# Altium project PWR_MANAGE.PRJPCB
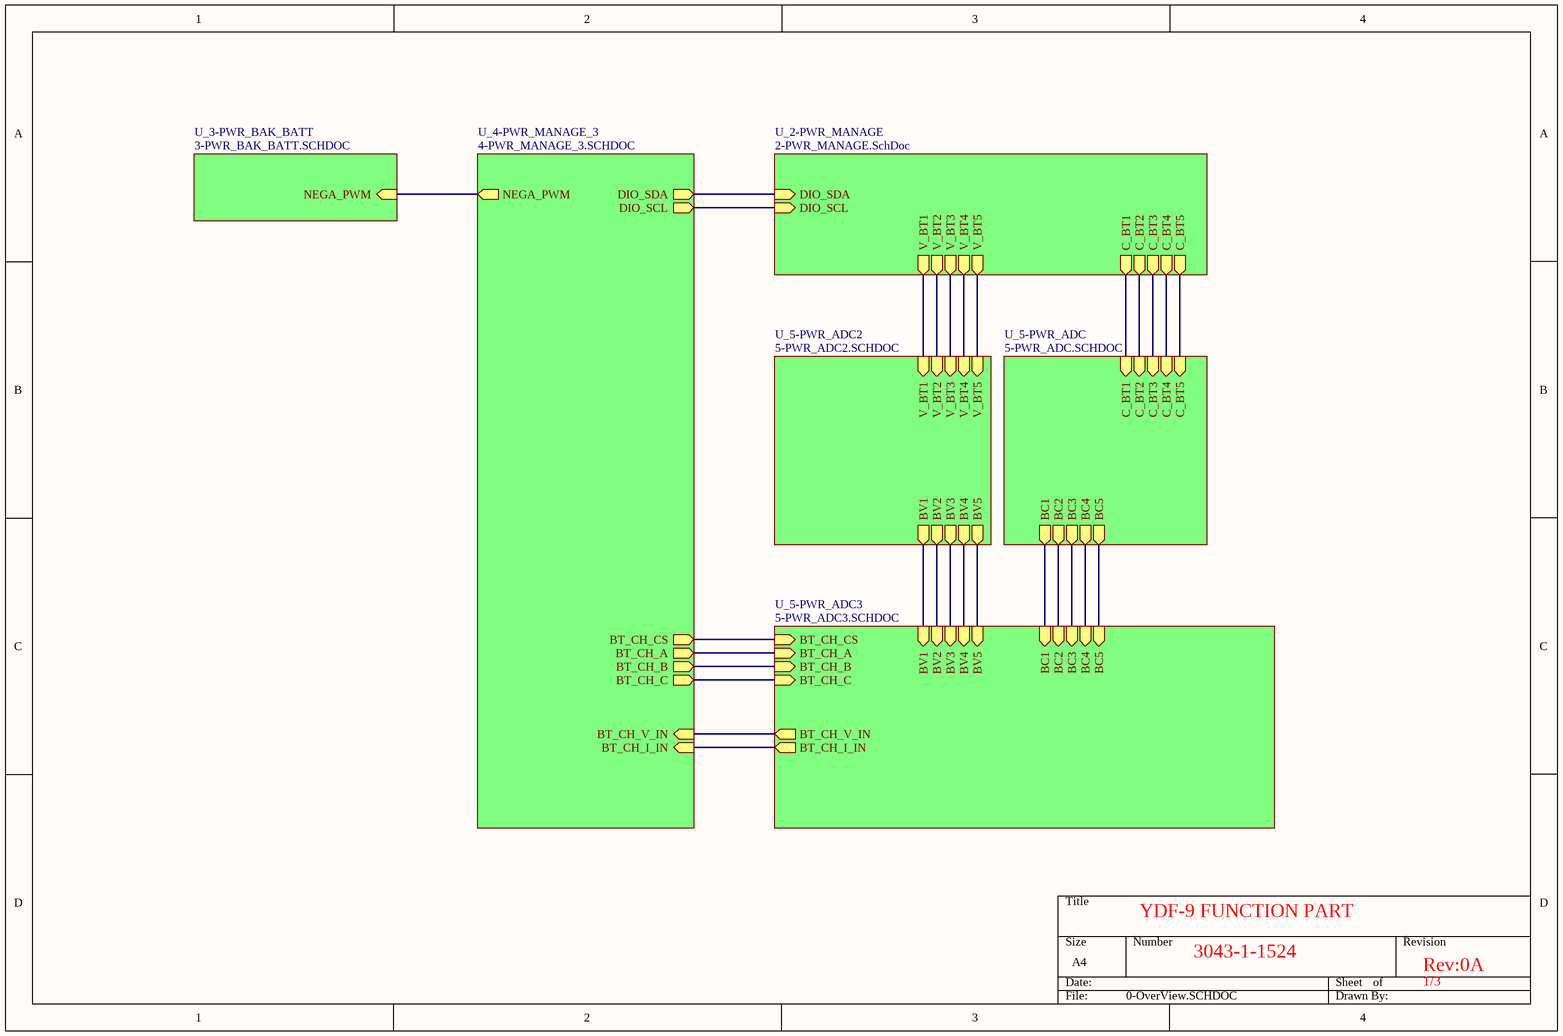
[diagram p0: 0-OverView.SCHDOC]
.TITLE: aaaaa
7 sheets, 171 parts. Net scope: hierarchical (ports join the sheet entries above them; power ports are global).
Board file: 3043-1-1532_Rev01.PcbDoc
Sheets:
  0-OverView.SCHDOC
    U_2-PWR_MANAGE = 2-PWR_MANAGE.SchDoc
    U_3-PWR_BAK_BATT = 3-PWR_BAK_BATT.SCHDOC
    U_4-PWR_MANAGE_3 = 4-PWR_MANAGE_3.SCHDOC
    U_5-PWR_ADC = 5-PWR_ADC.SCHDOC
    U_5-PWR_ADC2 = 5-PWR_ADC2.SCHDOC
    U_5-PWR_ADC3 = 5-PWR_ADC3.SCHDOC

## Sheet 0-OverView.SCHDOC
size A4

### Sub-sheets
U_2-PWR_MANAGE = 2-PWR_MANAGE.SchDoc: V_BT1 (out), V_BT2 (out), V_BT3 (out), V_BT4 (out), V_BT5 (out), C_BT1 (out), C_BT2 (out), C_BT3 (out), C_BT4 (out), C_BT5 (out), DIO_SDA (in), DIO_SCL (in)
U_3-PWR_BAK_BATT = 3-PWR_BAK_BATT.SCHDOC: NEGA_PWM (in)
U_4-PWR_MANAGE_3 = 4-PWR_MANAGE_3.SCHDOC: BT_CH_I_IN (in), BT_CH_V_IN (in), DIO_SDA (out), DIO_SCL (out), NEGA_PWM (out), BT_CH_CS (out), BT_CH_A (out), BT_CH_B (out), BT_CH_C (out)
U_5-PWR_ADC = 5-PWR_ADC.SCHDOC: C_BT1 (in), C_BT2 (in), C_BT3 (in), C_BT4 (in), C_BT5 (in), BC1 (out), BC2 (out), BC3 (out), BC4 (out), BC5 (out)
U_5-PWR_ADC2 = 5-PWR_ADC2.SCHDOC: V_BT1 (in), V_BT2 (in), V_BT3 (in), V_BT4 (in), V_BT5 (in), BV2 (out), BV3 (out), BV4 (out), BV5 (out), BV1 (out)
U_5-PWR_ADC3 = 5-PWR_ADC3.SCHDOC: BT_CH_CS (in), BT_CH_A (in), BT_CH_B (in), BT_CH_C (in), BT_CH_V_IN (out), BT_CH_I_IN (out), BC1 (in), BC2 (in), BC3 (in), BC4 (in), BC5 (in), BV1 (in), BV2 (in), BV3 (in), BV4 (in), BV5 (in)

### Nets
BC1: sheet U_5-PWR_ADC/BC1, sheet U_5-PWR_ADC3/BC1
BC2: sheet U_5-PWR_ADC/BC2, sheet U_5-PWR_ADC3/BC2
BC3: sheet U_5-PWR_ADC/BC3, sheet U_5-PWR_ADC3/BC3
BC4: sheet U_5-PWR_ADC/BC4, sheet U_5-PWR_ADC3/BC4
BC5: sheet U_5-PWR_ADC/BC5, sheet U_5-PWR_ADC3/BC5
BT_CH_A: sheet U_4-PWR_MANAGE_3/BT_CH_A, sheet U_5-PWR_ADC3/BT_CH_A
BT_CH_B: sheet U_4-PWR_MANAGE_3/BT_CH_B, sheet U_5-PWR_ADC3/BT_CH_B
BT_CH_C: sheet U_4-PWR_MANAGE_3/BT_CH_C, sheet U_5-PWR_ADC3/BT_CH_C
BT_CH_CS: sheet U_4-PWR_MANAGE_3/BT_CH_CS, sheet U_5-PWR_ADC3/BT_CH_CS
BT_CH_I_IN: sheet U_4-PWR_MANAGE_3/BT_CH_I_IN, sheet U_5-PWR_ADC3/BT_CH_I_IN
BT_CH_V_IN: sheet U_4-PWR_MANAGE_3/BT_CH_V_IN, sheet U_5-PWR_ADC3/BT_CH_V_IN
BV1: sheet U_5-PWR_ADC2/BV1, sheet U_5-PWR_ADC3/BV1
BV2: sheet U_5-PWR_ADC2/BV2, sheet U_5-PWR_ADC3/BV2
BV3: sheet U_5-PWR_ADC2/BV3, sheet U_5-PWR_ADC3/BV3
BV4: sheet U_5-PWR_ADC2/BV4, sheet U_5-PWR_ADC3/BV4
BV5: sheet U_5-PWR_ADC2/BV5, sheet U_5-PWR_ADC3/BV5
C_BT1: sheet U_2-PWR_MANAGE/C_BT1, sheet U_5-PWR_ADC/C_BT1
C_BT2: sheet U_2-PWR_MANAGE/C_BT2, sheet U_5-PWR_ADC/C_BT2
C_BT3: sheet U_2-PWR_MANAGE/C_BT3, sheet U_5-PWR_ADC/C_BT3
C_BT4: sheet U_2-PWR_MANAGE/C_BT4, sheet U_5-PWR_ADC/C_BT4
C_BT5: sheet U_2-PWR_MANAGE/C_BT5, sheet U_5-PWR_ADC/C_BT5
DIO_SCL: sheet U_2-PWR_MANAGE/DIO_SCL, sheet U_4-PWR_MANAGE_3/DIO_SCL
DIO_SDA: sheet U_2-PWR_MANAGE/DIO_SDA, sheet U_4-PWR_MANAGE_3/DIO_SDA
NEGA_PWM: sheet U_3-PWR_BAK_BATT/NEGA_PWM, sheet U_4-PWR_MANAGE_3/NEGA_PWM
V_BT1: sheet U_2-PWR_MANAGE/V_BT1, sheet U_5-PWR_ADC2/V_BT1
V_BT2: sheet U_2-PWR_MANAGE/V_BT2, sheet U_5-PWR_ADC2/V_BT2
V_BT3: sheet U_2-PWR_MANAGE/V_BT3, sheet U_5-PWR_ADC2/V_BT3
V_BT4: sheet U_2-PWR_MANAGE/V_BT4, sheet U_5-PWR_ADC2/V_BT4
V_BT5: sheet U_2-PWR_MANAGE/V_BT5, sheet U_5-PWR_ADC2/V_BT5

### Notes on the sheet
- YDF-9 FUNCTION PART
- 3043-1-1524
- Rev:0A
- 1/3

## Sheet 2-PWR_MANAGE.SchDoc
size A4
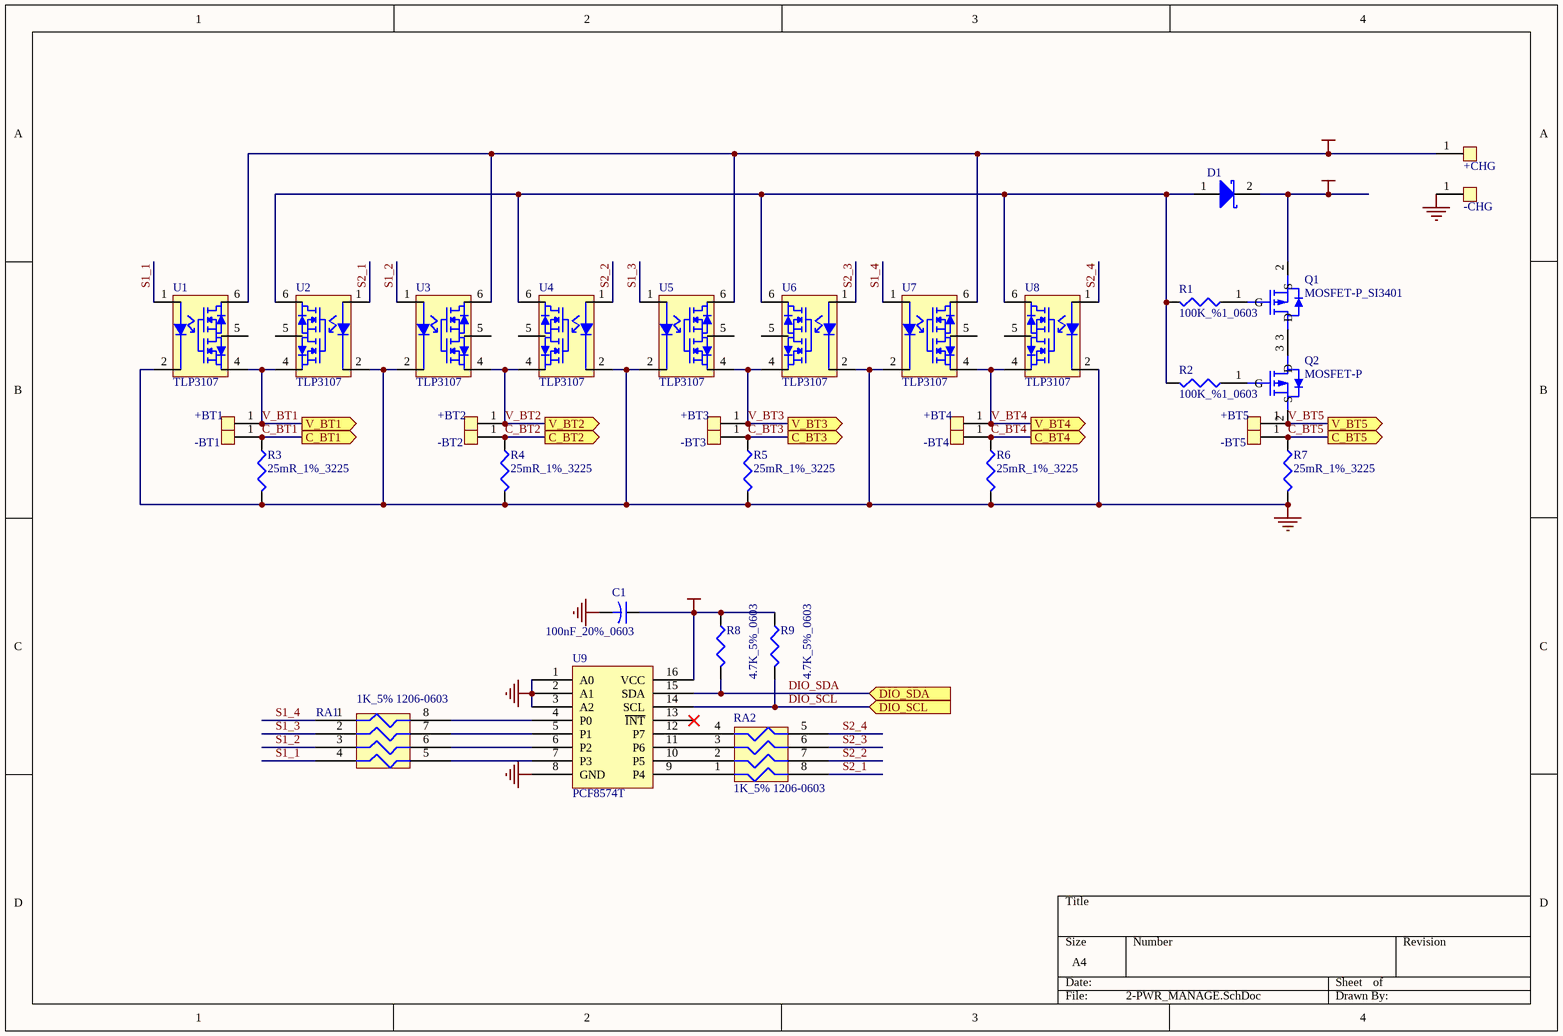
[diagram p1: 2-PWR_MANAGE.SchDoc]

### Parts
+BT1  ND  [END_1.5_2.2]  (value not drawn)
+BT2  ND  [END_1.5_2.2]  (value not drawn)
+BT3  ND  [END_1.5_2.2]  (value not drawn)
+BT4  ND  [END_1.5_2.2]  (value not drawn)
+BT5  ND  [END_1.5_2.2]  (value not drawn)
+CHG  ND  [END_1.5_2.2]  (value not drawn)
-BT1  ND  [END_1.5_2.2]  (value not drawn)
-BT2  ND  [END_1.5_2.2]  (value not drawn)
-BT3  ND  [END_1.5_2.2]  (value not drawn)
-BT4  ND  [END_1.5_2.2]  (value not drawn)
-BT5  ND  [END_1.5_2.2]  (value not drawn)
-CHG  ND  [END_1.5_2.2]  (value not drawn)
C1  100nF_20%_0603  [C1608-0603]
D1  D Schottky  [DO-214AA_785X100_200X160A100L_P]  (value not drawn)
Q1  MOSFET-P_SI3401  [SO-G3/C2.5]
Q2  MOSFET-P  [SO-G3/C2.5]
R1  value 100K_%1_0603  [C1608-0603]  (hidden comment: Res3)
R2  value 100K_%1_0603  [C1608-0603]  (hidden comment: Res3)
R3  25mR_1%_3225  [CR6332-2512]
R4  25mR_1%_3225  [CR6332-2512]
R5  25mR_1%_3225  [CR6332-2512]
R6  25mR_1%_3225  [CR6332-2512]
R7  25mR_1%_3225  [CR6332-2512]
R8  4.7K_5%_0603  [C1608-0603]
R9  4.7K_5%_0603  [C1608-0603]
RA1  1K_5% 1206-0603  [RCA-4]
RA2  1K_5% 1206-0603  [RCA-4]
U1  TLP3107  [SO-6_P2.54_B7]
U2  TLP3107  [SO-6_P2.54_B7]
U3  TLP3107  [SO-6_P2.54_B7]
U4  TLP3107  [SO-6_P2.54_B7]
U5  TLP3107  [SO-6_P2.54_B7]
U6  TLP3107  [SO-6_P2.54_B7]
U7  TLP3107  [SO-6_P2.54_B7]
U8  TLP3107  [SO-6_P2.54_B7]
U9  PCF8574T  [SOP16_P1.27_B10]

### Ports
C_BT1 (out), C_BT2 (out), C_BT3 (out), C_BT4 (out), C_BT5 (out), DIO_SCL (in), DIO_SDA (in), V_BT1 (out), V_BT2 (out), V_BT3 (out), V_BT4 (out), V_BT5 (out)

### Nets
GND: -CHG.1(SW) C1.2 R3.2 R4.2 R5.2 R6.2 R7.2 U1.2(K) U2.2(K) U3.2(K) U4.2(K) U5.2(K) U6.2(K) U7.2(K) U8.2(K) U9.1(A0) U9.2(A1) U9.3(A2) U9.8(GND)
VCC_3V3: C1.1 R8.1 R9.1 U9.16(VCC)
VCC_BAT: D1.2(K) Q1.2(S)
VCC_CHARGE: +CHG.1(SW) U1.6(A1) U3.6(A1) U5.6(A1) U7.6(A1)
C_BT1: -BT1.1(SW) R3.1 ; port C_BT1
C_BT2: -BT2.1(SW) R4.1 ; port C_BT2
C_BT3: -BT3.1(SW) R5.1 ; port C_BT3
C_BT4: -BT4.1(SW) R6.1 ; port C_BT4
C_BT5: -BT5.1(SW) R7.1 ; port C_BT5
DIO_SCL: R9.2 U9.14(SCL) ; port DIO_SCL
DIO_SDA: R8.2 U9.15(SDA) ; port DIO_SDA
S1_1: RA1.4 U1.1(A)
S1_2: RA1.3 U3.1(A)
S1_3: RA1.2 U5.1(A)
S1_4: RA1.1 U7.1(A)
S2_1: RA2.8 U2.1(A)
S2_2: RA2.7 U4.1(A)
S2_3: RA2.6 U6.1(A)
S2_4: RA2.5 U8.1(A)
V_BT1: +BT1.1(SW) U1.4(A2) U2.4(A2) ; port V_BT1
V_BT2: +BT2.1(SW) U3.4(A2) U4.4(A2) ; port V_BT2
V_BT3: +BT3.1(SW) U5.4(A2) U6.4(A2) ; port V_BT3
V_BT4: +BT4.1(SW) U7.4(A2) U8.4(A2) ; port V_BT4
V_BT5: +BT5.1(SW) Q2.2(S) ; port V_BT5
NetD1_1: D1.1(A) R1.2 R2.2 U2.6(A1) U4.6(A1) U6.6(A1) U8.6(A1)
NetQ1_1: Q1.1(G) R1.1
NetQ1_3: Q1.3(D) Q2.3(D)
NetQ2_1: Q2.1(G) R2.1
NetRA1_5: RA1.5 U9.7(P3)
NetRA1_6: RA1.6 U9.6(P2)
NetRA1_7: RA1.7 U9.5(P1)
NetRA1_8: RA1.8 U9.4(P0)
NetRA2_1: RA2.1 U9.9(P4)
NetRA2_2: RA2.2 U9.10(P5)
NetRA2_3: RA2.3 U9.11(P6)
NetRA2_4: RA2.4 U9.12(P7)

Not connected (* = marked no-connect by the designer): U1 3(NC) 5(+); U2 3(NC) 5(+); U3 3(NC) 5(+); U4 3(NC) 5(+); U5 3(NC) 5(+); U6 3(NC) 5(+); U7 3(NC) 5(+); U8 3(NC) 5(+); U9 13(~{INT})*

### Library data of the parts
C1 = Cap2: Capacitor; Value: 0.1uF; Published: 23-Sep-2002; Publisher: Altium Limited
D1 = D Schottky: Schottky Diode; Code - JEDEC: DO-214-AA; Published: 8-Jun-2000; Revision: July-2002: Re-released for DXP Platform.; Publisher: Altium Limited
Q1 = MOSFET-P
R1 R2 = Res3: Resistor; Published: 8-Jun-2000; Revision: July-2002: Re-released for DXP Platform.; Publisher: Altium Limited
R3-R7 = Res3: Resistor; Value: 150R %5 0603; Published: 8-Jun-2000; Revision: July-2002: Re-released for DXP Platform.; Publisher: Altium Limited
R8 R9 = Res3: Resistor; Value: 1K%5 0603; Published: 8-Jun-2000; Revision: July-2002: Re-released for DXP Platform.; Publisher: Altium Limited
RA1 RA2 = RESPACK1X4

## Sheet 3-PWR_BAK_BATT.SCHDOC
size A4
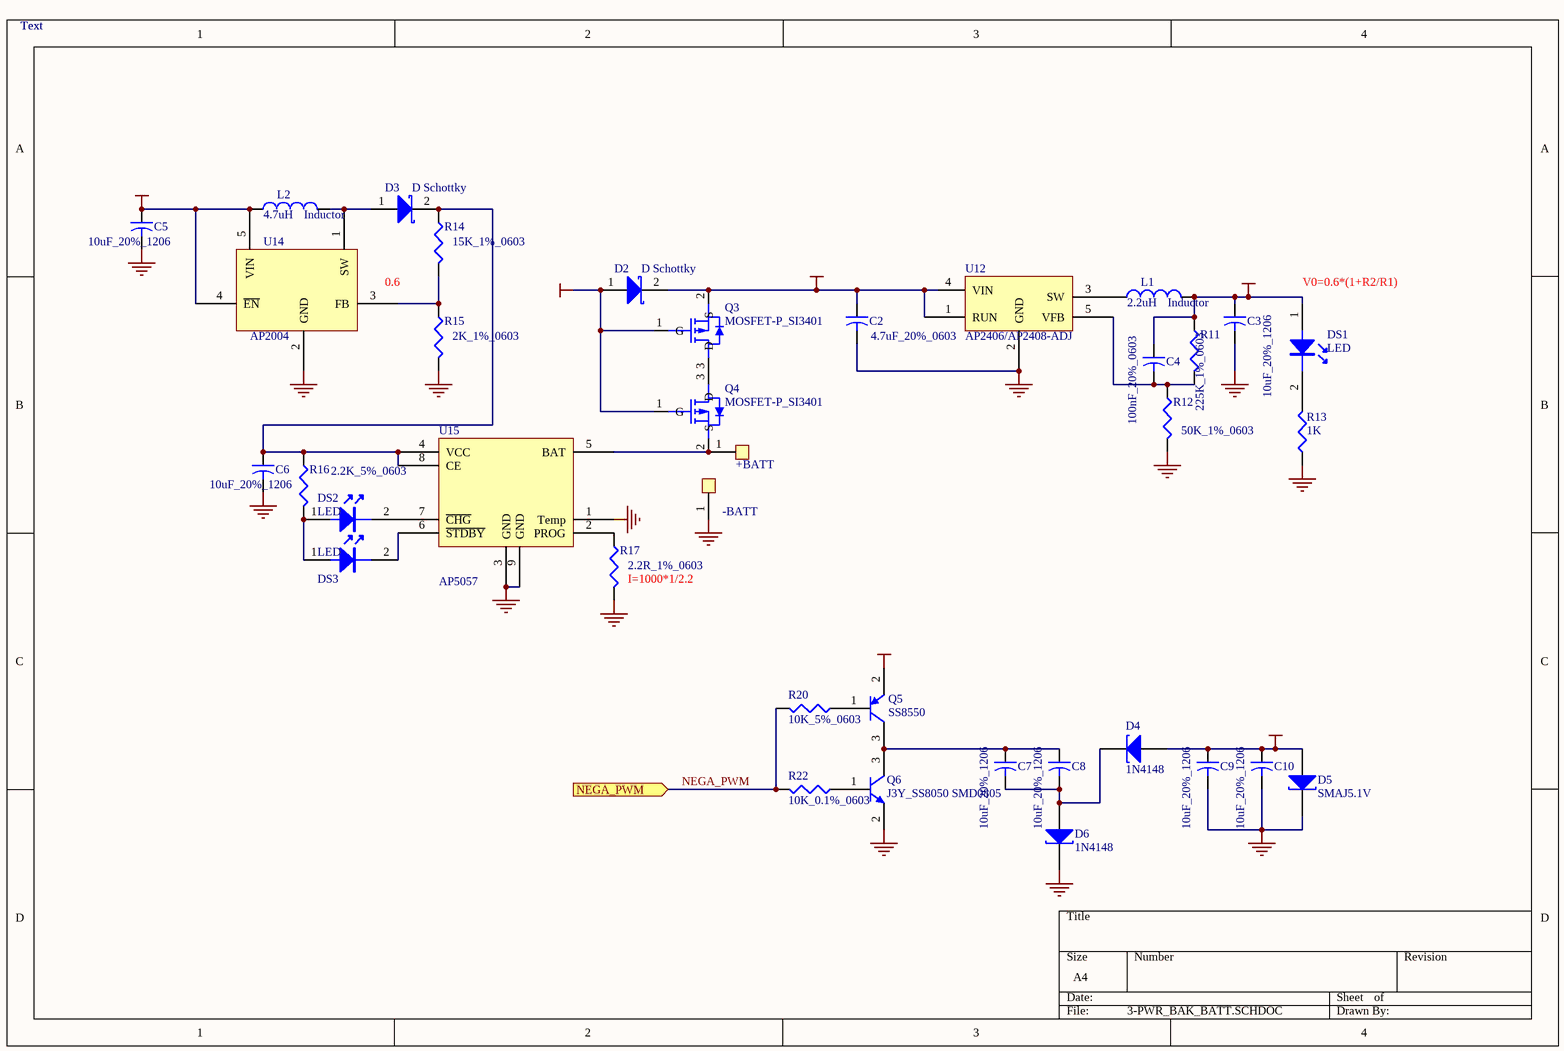
[diagram p2: 3-PWR_BAK_BATT.SCHDOC]

### Parts
+BATT  ND  [END_1.5_2.2]  (value not drawn)
-BATT  ND  [END_1.5_2.2]  (value not drawn)
C2  4.7uF_20%_0603  [C1608-0603]
C3  10uF_20%_1206  [CC3216-1206]
C4  100nF_20%_0603  [C1608-0603]
C5  10uF_20%_1206  [CC3216-1206]
C6  10uF_20%_1206  [CC3216-1206]
C7  10uF_20%_1206  [CC3216-1206]
C8  10uF_20%_1206  [CC3216-1206]
C9  10uF_20%_1206  [CC3216-1206]
C10  10uF_20%_1206  [CC3216-1206]
D2  D Schottky  [DO-214AA_785X100_200X160A100L_P]
D3  D Schottky  [DO-M7]
D4  1N4148  [DSO-F2/D6.1]
D5  SMAJ5.1V  [DSO-F2/D6.1]
D6  1N4148  [DSO-F2/D6.1]
DS1  LED  [LED0805]
DS2  LED  [LED0805]
DS3  LED  [LED0805]
L1  Inductor  value 2.2uH  [L6x6x3_3A]
L2  Inductor  value 4.7uH  [L6x6x3_3A]
Q3  MOSFET-P_SI3401  [SO-G3/C2.5]
Q4  MOSFET-P_SI3401  [SO-G3/C2.5]
Q5  SS8550  [SO-G3/C2.5]
Q6  J3Y_SS8050 SMD0805  [SO-G3/C2.5]
R11  225K_1%_0603  [C1608-0603]
R12  50K_1%_0603  [C1608-0603]
R13  value 1K  [C1608-0603]  (hidden comment: Res3)
R14  15K_1%_0603  [C1608-0603]
R15  2K_1%_0603  [C1608-0603]
R16  2.2K_5%_0603  [C1608-0603]
R17  2.2R_1%_0603  [C1608-0603]
R20  10K_5%_0603  [C1608-0603]
R22  10K_0.1%_0603  [C1608-0603]
U12  AP2406/AP2408-ADJ  [SOT23-5]
U14  AP2004  [SOT23-6]
U15  AP5057  [SON8-6_2-1_27]

### Ports
NEGA_PWM (in)

### Nets
GND: -BATT.1(SW) C2.2 C3.2 C5.2 C6.2 C9.2 C10.2 D5.2(K) D6.2(K) Q6.2(E) R12.2 R13.1 R15.2 R17.2 U12.2(GND) U14.2(GND) U15.1(Temp) U15.3(GND) U15.9(GND)
VCC_3V3: C3.1 C4.1 DS1.1 L1.2 Q5.2(E) R11.1
VCC_-3V3: C9.1 C10.1 D4.1(A) D5.1(A)
VCC_BAT: C5.1 D2.1(A) L2.1 Q3.1(G) Q4.1(G) U14.4(~{EN}) U14.5(VIN)
VCC_CTRL_5V: C2.1 D2.2(K) Q3.2(S) U12.1(RUN) U12.4(VIN)
NEGA_PWM: R20.2 R22.2 ; port NEGA_PWM
Net+BATT_1: +BATT.1(SW) Q4.2(S) U15.5(BAT)
NetC4_2: C4.2 R11.2 R12.1 U12.5(VFB)
NetC6_1: C6.1 D3.2(K) R14.1 R16.1 U15.4(VCC) U15.8(CE)
NetC7_1: C7.1 C8.1 Q5.3(C) Q6.3(C)
NetC7_2: C7.2 C8.2 D4.2(K) D6.1(A)
NetD3_1: D3.1(A) L2.2 U14.1(SW)
NetDS1_2: DS1.2 R13.2
NetDS2_1: DS2.1 DS3.1 R16.2
NetDS2_2: DS2.2 U15.7(~{CHG})
NetDS3_2: DS3.2 U15.6(~{STDBY})
NetL1_1: L1.1 U12.3(SW)
NetQ3_3: Q3.3(D) Q4.3(D)
NetQ5_1: Q5.1(B) R20.1
NetQ6_1: Q6.1(B) R22.1
NetR14_2: R14.2 R15.1 U14.3(FB)
NetR17_1: R17.1 U15.2(PROG)

### Notes on the sheet
- Text
- 0.6
- (near DS1) V0=0.6*(1+R2/R1)
- (near R17) I=1000*1/2.2

### Library data of the parts
C2 C4 = Cap2: Capacitor; Value: 0.1uF; Published: 23-Sep-2002; Publisher: Altium Limited
C3 C5 C6 = Cap2: Capacitor; Value: 10uF; Published: 23-Sep-2002; Publisher: Altium Limited
C7-C10 = Cap2: Capacitor; Value: 0.1uF 20% 0603; Published: 23-Sep-2002; Publisher: Altium Limited
D2 D3 = D Schottky: Schottky Diode; Code - JEDEC: DO-214-AA; Published: 8-Jun-2000; Revision: July-2002: Re-released for DXP Platform.; Publisher: Altium Limited
D4-D6 = D Tunnel1: Tunnel Diode - RLC Model; Published: 8-Jun-2000; LatestRevisionDate: 17-Jul-2002; LatestRevisionNote: Re-released for DXP Platform.; Publisher: Altium Limited
Q3 Q4 = MOSFET-P
Q5 = 2N3906: PNP General Purpose Amplifier; Published: 8-Jun-2000; LatestRevisionDate: 15-Jan-2003; LatestRevisionNote: PCB Footprint 'BCY-W3/D4.7' replaced; DatasheetDocument: 1997; PackageReference: TO-92A; Publisher: Altium Limited; Code_JEDEC: TO-92A
Q6 = QNPN: NPN Bipolar Transistor; Code - JEDEC: SOT-23; Published: 8-Jun-2000; Revision: July-2002: Re-released for DXP Platform.; Publisher: Altium Limited
R11 R12 R14-R17 = Res3: Resistor; Value: 1K%5 0603; Published: 8-Jun-2000; Revision: July-2002: Re-released for DXP Platform.; Publisher: Altium Limited
R13 = Res3: Resistor; Published: 8-Jun-2000; Revision: July-2002: Re-released for DXP Platform.; Publisher: Altium Limited
R20 R22 = Res3: Resistor; Value: 150R %5 0603; Published: 8-Jun-2000; Revision: July-2002: Re-released for DXP Platform.; Publisher: Altium Limited
U12 = AP2406
L1 L2 = Inductor: Published: 8-Jun-2000; Revision: July-2002: Re-released for DXP Platform.; Publisher: Altium Limited

## Sheet 4-PWR_MANAGE_3.SCHDOC
size A4
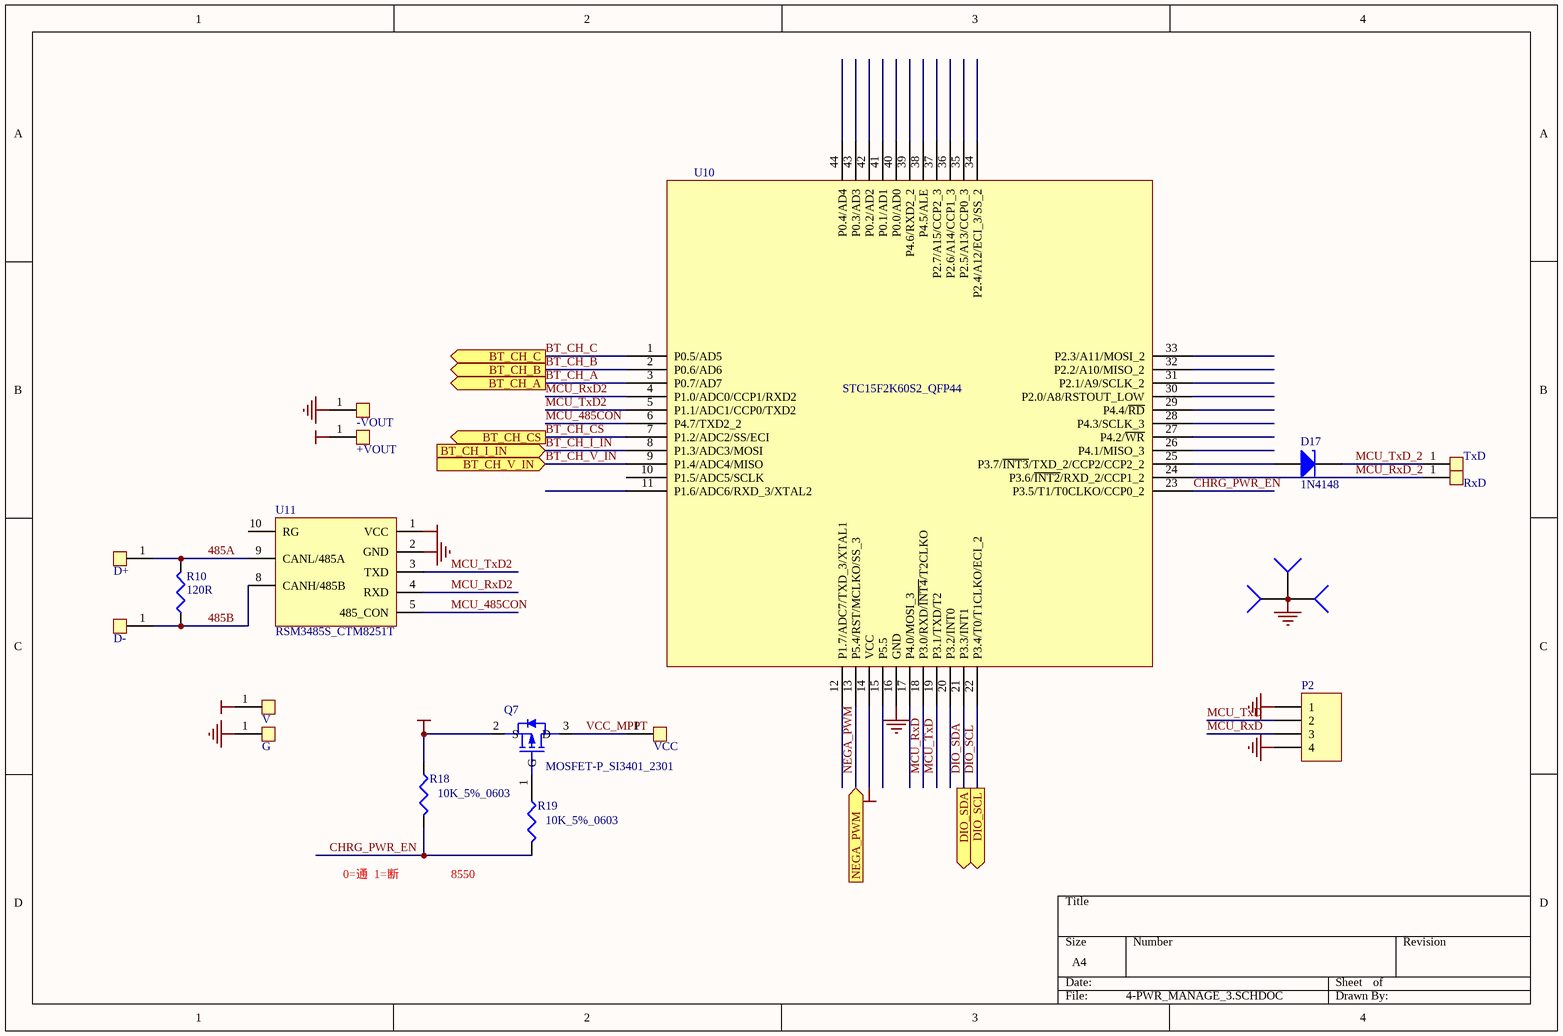
[diagram p3: 4-PWR_MANAGE_3.SCHDOC]

### Parts
+VOUT  ND  [END_1.5_2.2]  (value not drawn)
-VOUT  ND  [END_1.5_2.2]  (value not drawn)
D17  1N4148  [DSO-F2/D6.1]
D+  ND  [END_1.5_2.2]  (value not drawn)
D-  ND  [END_1.5_2.2]  (value not drawn)
G  ND  [END_1.5_2.2]  (value not drawn)
J1  COAX-F  [PAD_GND]  (value not drawn)
J2  COAX-F  [PAD_GND]  (value not drawn)
J3  COAX-F  [PAD_GND]  (value not drawn)
P2  Header 4  [XH-04H]  (value not drawn)
Q7  MOSFET-P_SI3401_2301  [SO-G3/C2.5]
R10  value 120R  [C1608-0603]  (hidden comment: Res3)
R18  10K_5%_0603  [C1608-0603]
R19  10K_5%_0603  [C1608-0603]
RxD  ND  [END_1.5_2.2]  (value not drawn)
TxD  ND  [END_1.5_2.2]  (value not drawn)
U10  STC15F2K60S2_QFP44  [PQFP44]
U11  RSM3485S_CTM8251T  [RSM485]
V  ND  [END_1.5_2.2]  (value not drawn)
VCC  ND  [END_1.5_2.2]  (value not drawn)

### Ports
BT_CH_A (out), BT_CH_B (out), BT_CH_C (out), BT_CH_CS (out), BT_CH_I_IN (in), BT_CH_V_IN (in), DIO_SCL (out), DIO_SDA (out), NEGA_PWM (in)

### Nets
GND: -VOUT.1(SW) G.1(SW) J1.1(A) J2.1(A) J3.1(A) P2.1 P2.4 U10.16(GND) U11.2(GND)
VCC_3V3: U10.14(VCC) U11.1(VCC)
VCC_BAT: +VOUT.1(SW)
VCC_CTRL_5V: Q7.2(S) R18.1 V.1(SW)
485A: D+.1(SW) R10.2 U11.9(CANL/485A)
485B: D-.1(SW) R10.1 U11.8(CANH/485B)
BT_CH_A: U10.3(P0.7/AD7) ; port BT_CH_A
BT_CH_B: U10.2(P0.6/AD6) ; port BT_CH_B
BT_CH_C: U10.1(P0.5/AD5) ; port BT_CH_C
BT_CH_CS: U10.7(P1.2/ADC2/SS/ECI) ; port BT_CH_CS
BT_CH_I_IN: U10.8(P1.3/ADC3/MOSI) ; port BT_CH_I_IN
BT_CH_V_IN: U10.9(P1.4/ADC4/MISO) ; port BT_CH_V_IN
CHRG_PWR_EN: R18.2 R19.2 U10.23(P3.5/T1/T0CLKO/CCP0_2)
DIO_SCL: U10.22(P3.4/T0/T1CLKO/ECI_2) ; port DIO_SCL
DIO_SDA: U10.21(P3.3/INT1) ; port DIO_SDA
MCU_485CON: U10.6(P4.7/TXD2_2) U11.5(485_CON)
MCU_RxD: P2.3 U10.18(P3.0/RXD/~{INT4}/T2CLKO)
MCU_RxD2: U10.4(P1.0/ADC0/CCP1/RXD2) U11.4(RXD)
MCU_RxD_2: RxD.1(SW) U10.24(P3.6/~{INT2}/RXD_2/CCP1_2)
MCU_TxD: P2.2 U10.19(P3.1/TXD/T2)
MCU_TxD2: U10.5(P1.1/ADC1/CCP0/TXD2) U11.3(TXD)
MCU_TxD_2: D17.2(K) TxD.1(SW)
NEGA_PWM: U10.13(P5.4/RST/MCLKO/SS_3) ; port NEGA_PWM
VCC_MPPT: Q7.3(D) VCC.1(SW)
NetD17_1: D17.1(A) U10.25(P3.7/~{INT3}/TXD_2/CCP2/CCP2_2)
NetQ7_1: Q7.1(G) R19.1

Not connected (* = marked no-connect by the designer): U10 10(P1.5/ADC5/SCLK) 11(P1.6/ADC6/RXD_3/XTAL2) 12(P1.7/ADC7/TXD_3/XTAL1) 15(P5.5) 17(P4.0/MOSI_3) 20(P3.2/INT0) 26(P4.1/MISO_3) 27(P4.2/~{WR}) 28(P4.3/SCLK_3) 29(P4.4/~{RD}) 30(P2.0/A8/RSTOUT_LOW) 31(P2.1/A9/SCLK_2) 32(P2.2/A10/MISO_2) 33(P2.3/A11/MOSI_2) 34(P2.4/A12/ECI_3/SS_2) 35(P2.5/A13/CCP0_3) 36(P2.6/A14/CCP1_3) 37(P2.7/A15/CCP2_3) 38(P4.5/ALE) 39(P4.6/RXD2_2) 40(P0.0/AD0) 41(P0.1/AD1) 42(P0.2/AD2) 43(P0.3/AD3) 44(P0.4/AD4); U11 10(RG)

### Notes on the sheet
- 0=通  1=断
- 8550

### Library data of the parts
D17 = D Tunnel1: Tunnel Diode - RLC Model; Published: 8-Jun-2000; LatestRevisionDate: 17-Jul-2002; LatestRevisionNote: Re-released for DXP Platform.; Publisher: Altium Limited
J1-J3 = COAX-F: Coax-F Connector; Revision: 17-Jul-2002: Re-released for DXP Platform.; Publisher: Altium Limited
P2 = Header 4: Header, 4-Pin; LatestRevisionDate: 17-Jul-2002; LatestRevisionNote: Re-released for DXP Platform.; Publisher: Altium Limited
Q7 = MOSFET-P
R10 = Res3: Resistor; Published: 8-Jun-2000; Revision: July-2002: Re-released for DXP Platform.; Publisher: Altium Limited
R18 R19 = Res3: Resistor; Value: 1K%5 0603; Published: 8-Jun-2000; Revision: July-2002: Re-released for DXP Platform.; Publisher: Altium Limited
U11 = RSM485S_CTM8251T

## Sheet 5-PWR_ADC.SCHDOC
size A4
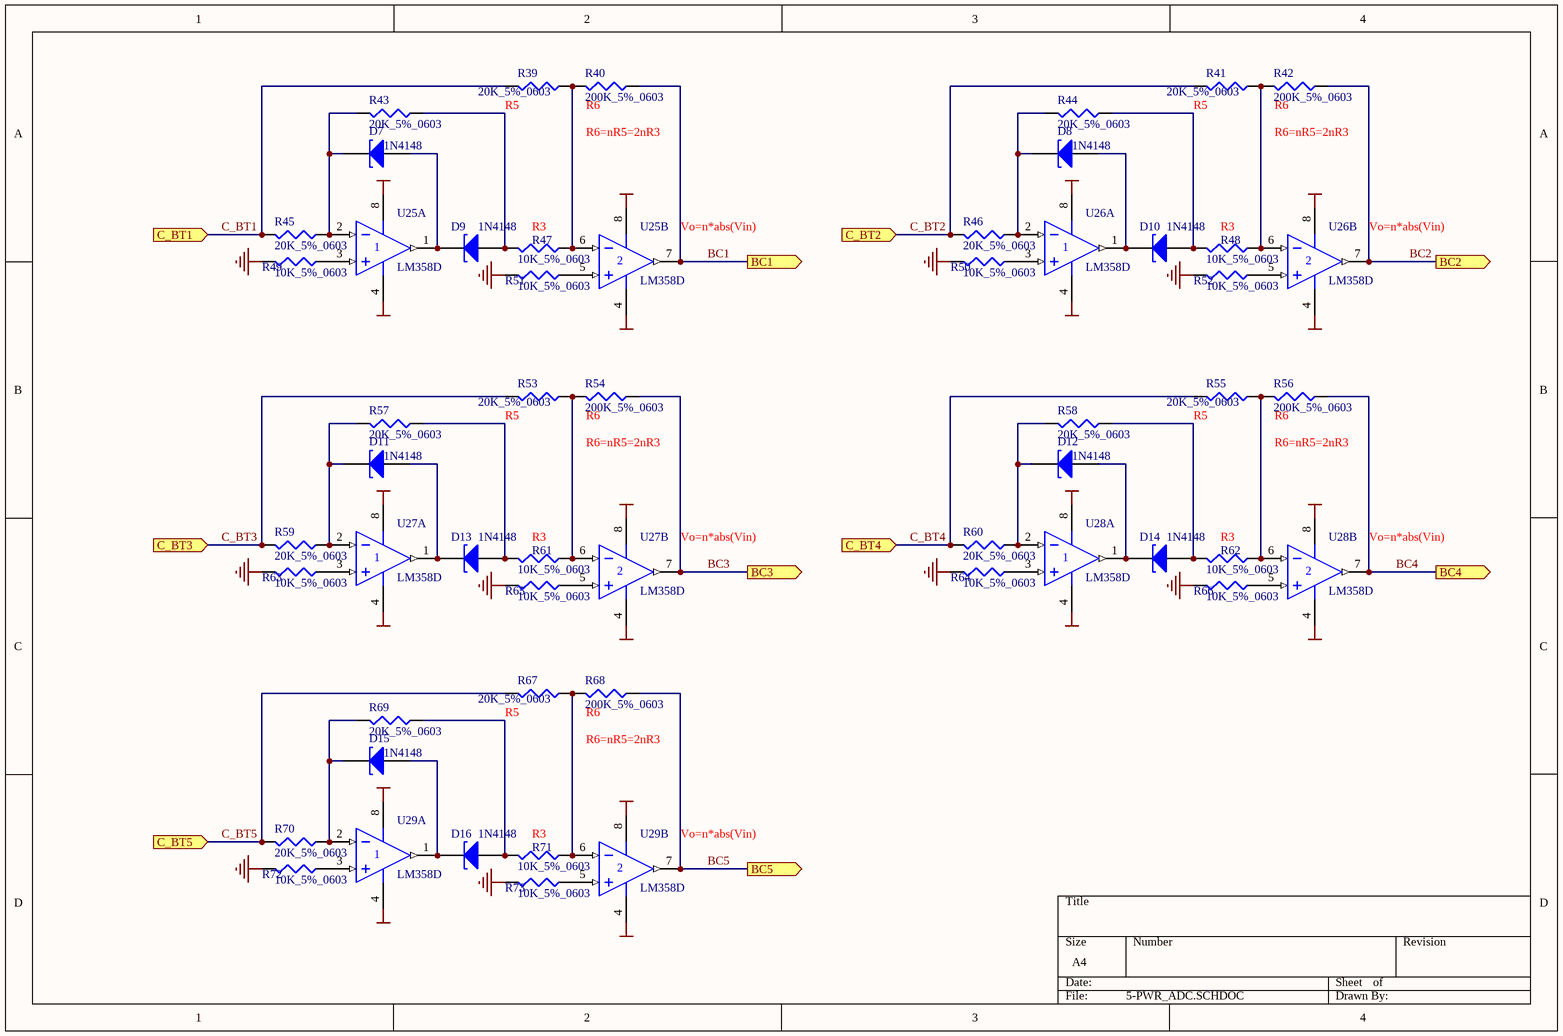
[diagram p4: 5-PWR_ADC.SCHDOC]

### Parts
D7  1N4148  [DSO-F2/D6.1]
D8  1N4148  [DSO-F2/D6.1]
D9  1N4148  [DSO-F2/D6.1]
D10  1N4148  [DSO-F2/D6.1]
D11  1N4148  [DSO-F2/D6.1]
D12  1N4148  [DSO-F2/D6.1]
D13  1N4148  [DSO-F2/D6.1]
D14  1N4148  [DSO-F2/D6.1]
D15  1N4148  [DSO-F2/D6.1]
D16  1N4148  [DSO-F2/D6.1]
R39  20K_5%_0603  [C1608-0603]
R40  200K_5%_0603  [C1608-0603]
R41  20K_5%_0603  [C1608-0603]
R42  200K_5%_0603  [C1608-0603]
R43  20K_5%_0603  [C1608-0603]
R44  20K_5%_0603  [C1608-0603]
R45  20K_5%_0603  [C1608-0603]
R46  20K_5%_0603  [C1608-0603]
R47  10K_5%_0603  [C1608-0603]
R48  10K_5%_0603  [C1608-0603]
R49  10K_5%_0603  [C1608-0603]
R50  10K_5%_0603  [C1608-0603]
R51  10K_5%_0603  [C1608-0603]
R52  10K_5%_0603  [C1608-0603]
R53  20K_5%_0603  [C1608-0603]
R54  200K_5%_0603  [C1608-0603]
R55  20K_5%_0603  [C1608-0603]
R56  200K_5%_0603  [C1608-0603]
R57  20K_5%_0603  [C1608-0603]
R58  20K_5%_0603  [C1608-0603]
R59  20K_5%_0603  [C1608-0603]
R60  20K_5%_0603  [C1608-0603]
R61  10K_5%_0603  [C1608-0603]
R62  10K_5%_0603  [C1608-0603]
R63  10K_5%_0603  [C1608-0603]
R64  10K_5%_0603  [C1608-0603]
R65  10K_5%_0603  [C1608-0603]
R66  10K_5%_0603  [C1608-0603]
R67  20K_5%_0603  [C1608-0603]
R68  200K_5%_0603  [C1608-0603]
R69  20K_5%_0603  [C1608-0603]
R70  20K_5%_0603  [C1608-0603]
R71  10K_5%_0603  [C1608-0603]
R72  10K_5%_0603  [C1608-0603]
R73  10K_5%_0603  [C1608-0603]
U25  LM358D  [751-02]  (parts A,B of 2)
U26  LM358D  [751-02]  (parts A,B of 2)
U27  LM358D  [751-02]  (parts A,B of 2)
U28  LM358D  [751-02]  (parts A,B of 2)
U29  LM358D  [751-02]  (parts A,B of 2)

### Ports
BC1 (out), BC2 (out), BC3 (out), BC4 (out), BC5 (out), C_BT1 (in), C_BT2 (in), C_BT3 (in), C_BT4 (in), C_BT5 (in)

### Nets
GND: R49.2 R50.2 R51.2 R52.2 R63.2 R64.2 R65.2 R66.2 R72.2 R73.2
VCC_3V3: U25.8(V+) U26.8(V+) U27.8(V+) U28.8(V+) U29.8(V+)
VCC_-3V3: U25.4(V-) U26.4(V-) U27.4(V-) U28.4(V-) U29.4(V-)
BC1: R40.1 U25.7(OUT) ; port BC1
BC2: R42.1 U26.7(OUT) ; port BC2
BC3: R54.1 U27.7(OUT) ; port BC3
BC4: R56.1 U28.7(OUT) ; port BC4
BC5: R68.1 U29.7(OUT) ; port BC5
C_BT1: R39.2 R45.2 ; port C_BT1
C_BT2: R41.2 R46.2 ; port C_BT2
C_BT3: R53.2 R59.2 ; port C_BT3
C_BT4: R55.2 R60.2 ; port C_BT4
C_BT5: R67.2 R70.2 ; port C_BT5
NetD7_1: D7.1(A) D9.2(K) U25.1(OUT)
NetD7_2: D7.2(K) R43.2 R45.1 U25.2(IN-)
NetD8_1: D8.1(A) D10.2(K) U26.1(OUT)
NetD8_2: D8.2(K) R44.2 R46.1 U26.2(IN-)
NetD9_1: D9.1(A) R43.1 R47.2
NetD10_1: D10.1(A) R44.1 R48.2
NetD11_1: D11.1(A) D13.2(K) U27.1(OUT)
NetD11_2: D11.2(K) R57.2 R59.1 U27.2(IN-)
NetD12_1: D12.1(A) D14.2(K) U28.1(OUT)
NetD12_2: D12.2(K) R58.2 R60.1 U28.2(IN-)
NetD13_1: D13.1(A) R57.1 R61.2
NetD14_1: D14.1(A) R58.1 R62.2
NetD15_1: D15.1(A) D16.2(K) U29.1(OUT)
NetD15_2: D15.2(K) R69.2 R70.1 U29.2(IN-)
NetD16_1: D16.1(A) R69.1 R71.2
NetR39_1: R39.1 R40.2 R47.1 U25.6(IN-)
NetR41_1: R41.1 R42.2 R48.1 U26.6(IN-)
NetR49_1: R49.1 U25.3(IN+)
NetR50_1: R50.1 U26.3(IN+)
NetR51_1: R51.1 U25.5(IN+)
NetR52_1: R52.1 U26.5(IN+)
NetR53_1: R53.1 R54.2 R61.1 U27.6(IN-)
NetR55_1: R55.1 R56.2 R62.1 U28.6(IN-)
NetR63_1: R63.1 U27.3(IN+)
NetR64_1: R64.1 U28.3(IN+)
NetR65_1: R65.1 U27.5(IN+)
NetR66_1: R66.1 U28.5(IN+)
NetR67_1: R67.1 R68.2 R71.1 U29.6(IN-)
NetR72_1: R72.1 U29.3(IN+)
NetR73_1: R73.1 U29.5(IN+)

### Notes on the sheet
- (near R39) R5
- (near R40) R6
- (near R41) R5
- (near R42) R6
- R6=nR5=2nR3
- (near R47) R3
- (near U25) Vo=n*abs(Vin)
- (near R48) R3
- (near U26) Vo=n*abs(Vin)
- (near R53) R5
- (near R54) R6
- (near R55) R5
- (near R56) R6
- (near R61) R3
- (near U27) Vo=n*abs(Vin)
- (near R62) R3
- (near U28) Vo=n*abs(Vin)
- (near R67) R5
- (near R68) R6
- (near R71) R3
- (near U29) Vo=n*abs(Vin)

### Library data of the parts
D7-D16 = D Tunnel1: Tunnel Diode - RLC Model; Published: 8-Jun-2000; LatestRevisionDate: 17-Jul-2002; LatestRevisionNote: Re-released for DXP Platform.; Publisher: Altium Limited
R39-R73 = Res3: Resistor; Value: 150R %5 0603; Published: 8-Jun-2000; Revision: July-2002: Re-released for DXP Platform.; Publisher: Altium Limited
U25-U29 = LM358D: Dual Low-Power Operational Amplifier; Published: 17-Jul-2002; DatasheetDocument: 1988; PackageReference: 751-02; Publisher: Altium Limited; Code_JEDEC: MS-012-AA; Code_IPC: SO8

## Sheet 5-PWR_ADC2.SCHDOC
size A4
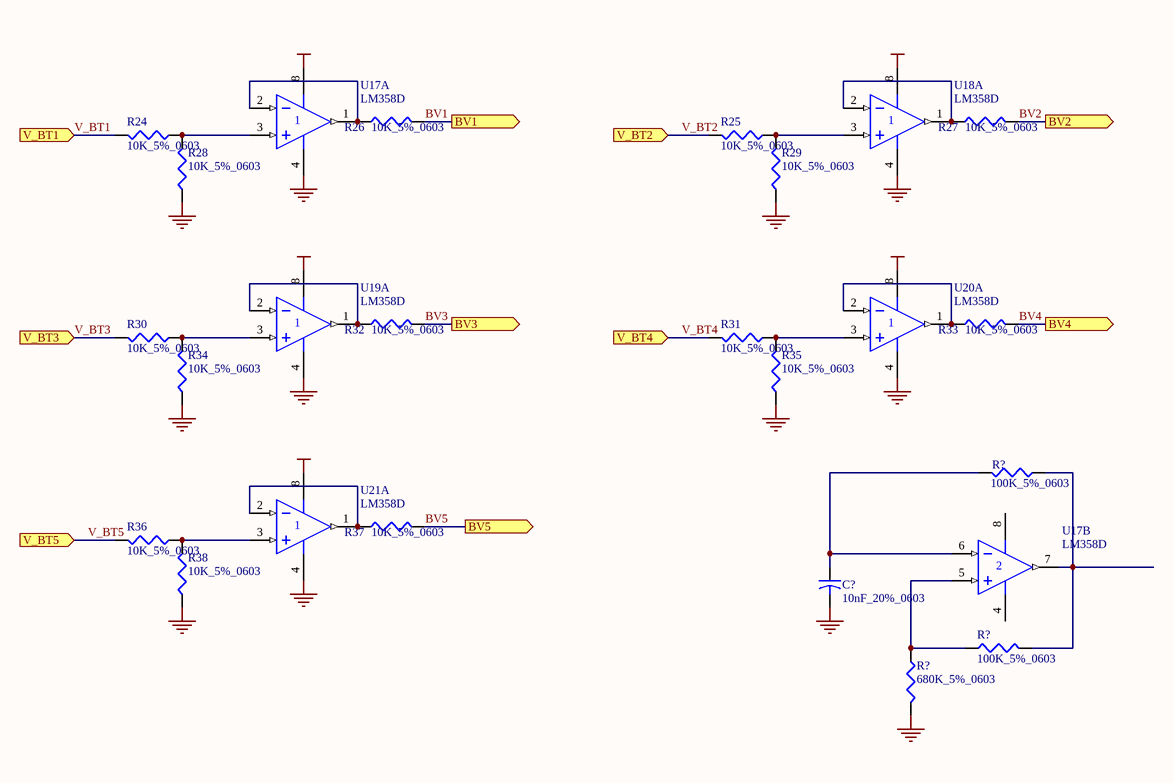
[diagram p5: 5-PWR_ADC2.SCHDOC]

### Parts
(Parts that share a designator on the sheet are numbered #1, #2 ... from top to bottom, then left to right.)
C?  10nF_20%_0603  [C1608-0603]
R24  10K_5%_0603  [C1608-0603]
R25  10K_5%_0603  [C1608-0603]
R26  10K_5%_0603  [C1608-0603]
R27  10K_5%_0603  [C1608-0603]
R28  10K_5%_0603  [C1608-0603]
R29  10K_5%_0603  [C1608-0603]
R30  10K_5%_0603  [C1608-0603]
R31  10K_5%_0603  [C1608-0603]
R32  10K_5%_0603  [C1608-0603]
R33  10K_5%_0603  [C1608-0603]
R34  10K_5%_0603  [C1608-0603]
R35  10K_5%_0603  [C1608-0603]
R36  10K_5%_0603  [C1608-0603]
R37  10K_5%_0603  [C1608-0603]
R38  10K_5%_0603  [C1608-0603]
R?#1  100K_5%_0603  [C1608-0603]
R?#2  100K_5%_0603  [C1608-0603]
R?#3  680K_5%_0603  [C1608-0603]
U17  LM358D  [751-02]  (parts A,B of 2)
U18  LM358D  [751-02]  (part A of 2)
U19  LM358D  [751-02]  (part A of 2)
U20  LM358D  [751-02]  (part A of 2)
U21  LM358D  [751-02]  (part A of 2)

### Ports
BV1 (out), BV2 (out), BV3 (out), BV4 (out), BV5 (out), V_BT1 (in), V_BT2 (in), V_BT3 (in), V_BT4 (in), V_BT5 (in)

### Nets
GND: C?.2 R28.1 R29.1 R34.1 R35.1 R38.1 R?#3.2 U17.4(V-) U18.4(V-) U19.4(V-) U20.4(V-) U21.4(V-)
VCC_3V3: U17.8(V+) U18.8(V+) U19.8(V+) U20.8(V+) U21.8(V+)
BV1: R26.2 ; port BV1
BV2: R27.2 ; port BV2
BV3: R32.2 ; port BV3
BV4: R33.2 ; port BV4
BV5: R37.2 ; port BV5
V_BT1: R24.2 ; port V_BT1
V_BT2: R25.2 ; port V_BT2
V_BT3: R30.2 ; port V_BT3
V_BT4: R31.2 ; port V_BT4
V_BT5: R36.2 ; port V_BT5
NetC?_1: C?.1 R?#1.2 U17.6(IN-)
NetR24_1: R24.1 R28.2 U17.3(IN+)
NetR25_1: R25.1 R29.2 U18.3(IN+)
NetR26_1: R26.1 U17.1(OUT) U17.2(IN-)
NetR27_1: R27.1 U18.1(OUT) U18.2(IN-)
NetR30_1: R30.1 R34.2 U19.3(IN+)
NetR31_1: R31.1 R35.2 U20.3(IN+)
NetR32_1: R32.1 U19.1(OUT) U19.2(IN-)
NetR33_1: R33.1 U20.1(OUT) U20.2(IN-)
NetR36_1: R36.1 R38.2 U21.3(IN+)
NetR37_1: R37.1 U21.1(OUT) U21.2(IN-)
NetR?#1_1: R?#1.1 R?#2.2 U17.7(OUT)
NetR?#2_1: R?#2.1 R?#3.1 U17.5(IN+)

### Library data of the parts
C? = Cap2: Capacitor; Value: 0.1uF; Published: 23-Sep-2002; Publisher: Altium Limited
R24-R38 R?#1-R?#3 = Res3: Resistor; Value: 150R %5 0603; Published: 8-Jun-2000; Revision: July-2002: Re-released for DXP Platform.; Publisher: Altium Limited
U17-U21 = LM358D: Dual Low-Power Operational Amplifier; Published: 17-Jul-2002; DatasheetDocument: 1988; PackageReference: 751-02; Publisher: Altium Limited; Code_JEDEC: MS-012-AA; Code_IPC: SO8

## Sheet 5-PWR_ADC3.SCHDOC
size A4
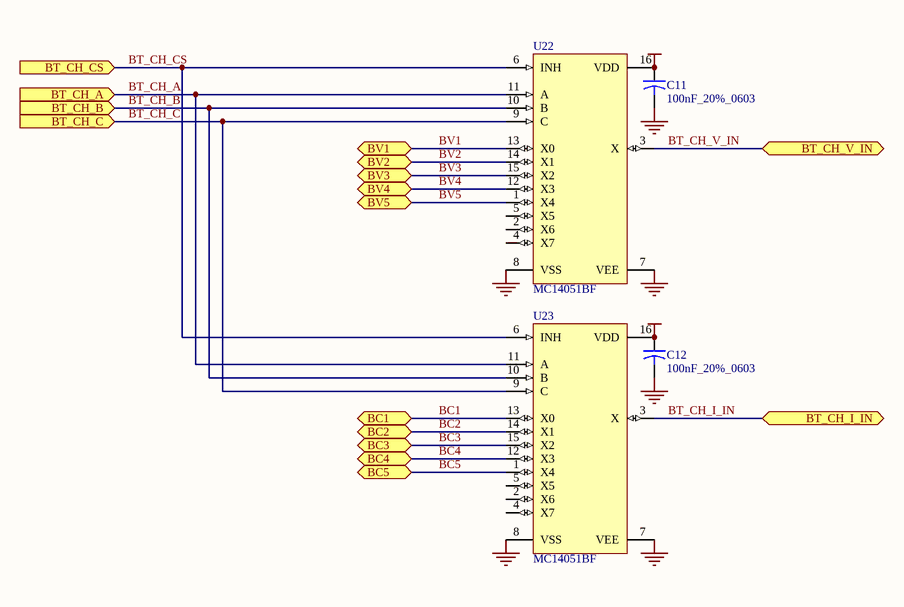
[diagram p6: 5-PWR_ADC3.SCHDOC]

### Parts
C11  100nF_20%_0603  [C1608-0603]
C12  100nF_20%_0603  [C1608-0603]
U22  MC14051BF  [966-01]
U23  MC14051BF  [966-01]

### Ports
BC1 (bidir), BC2 (bidir), BC3 (bidir), BC4 (bidir), BC5 (bidir), BT_CH_A (in), BT_CH_B (in), BT_CH_C (in), BT_CH_CS (in), BT_CH_I_IN (bidir), BT_CH_V_IN (bidir), BV1 (bidir), BV2 (bidir), BV3 (bidir), BV4 (bidir), BV5 (bidir)

### Nets
GND: C11.2 C12.2 U22.7(VEE) U22.8(VSS) U23.7(VEE) U23.8(VSS)
VCC_3V3: C11.1 C12.1 U22.16(VDD) U23.16(VDD)
BC1: U23.13(X0) ; port BC1
BC2: U23.14(X1) ; port BC2
BC3: U23.15(X2) ; port BC3
BC4: U23.12(X3) ; port BC4
BC5: U23.1(X4) ; port BC5
BT_CH_A: U22.11(A) U23.11(A) ; port BT_CH_A
BT_CH_B: U22.10(B) U23.10(B) ; port BT_CH_B
BT_CH_C: U22.9(C) U23.9(C) ; port BT_CH_C
BT_CH_CS: U22.6(INH) U23.6(INH) ; port BT_CH_CS
BT_CH_I_IN: U23.3(X) ; port BT_CH_I_IN
BT_CH_V_IN: U22.3(X) ; port BT_CH_V_IN
BV1: U22.13(X0) ; port BV1
BV2: U22.14(X1) ; port BV2
BV3: U22.15(X2) ; port BV3
BV4: U22.12(X3) ; port BV4
BV5: U22.1(X4) ; port BV5

Not connected (* = marked no-connect by the designer): U22 2(X6) 4(X7) 5(X5); U23 2(X6) 4(X7) 5(X5)

### Library data of the parts
C11 C12 = Cap2: Capacitor; Value: 0.1uF; Published: 23-Sep-2002; Publisher: Altium Limited
U22 U23 = MC14051BF: 8-Channel Analog Multiplexer/Demultiplexer; Published: 17-Jul-2002; DatasheetDocument: Mar-2000; PackageDocument: Mar-2000; PackageReference: 966-01; Publisher: Altium Limited

## Nets that join several sheets
GND: 2-PWR_MANAGE (19 pins), 3-PWR_BAK_BATT (19 pins), 4-PWR_MANAGE_3 (9 pins), 5-PWR_ADC (10 pins), 5-PWR_ADC2 (12 pins), 5-PWR_ADC3 (6 pins)
VCC_3V3: 2-PWR_MANAGE (C1.1 R8.1 R9.1 U9.16), 3-PWR_BAK_BATT (6 pins), 4-PWR_MANAGE_3 (U10.14 U11.1), 5-PWR_ADC (5 pins), 5-PWR_ADC2 (5 pins), 5-PWR_ADC3 (C11.1 C12.1 U22.16 U23.16)
VCC_-3V3: 3-PWR_BAK_BATT (C9.1 C10.1 D4.1 D5.1), 5-PWR_ADC (5 pins)
VCC_BAT: 2-PWR_MANAGE (D1.2 Q1.2), 3-PWR_BAK_BATT (7 pins), 4-PWR_MANAGE_3 (+VOUT.1)
VCC_CTRL_5V: 3-PWR_BAK_BATT (5 pins), 4-PWR_MANAGE_3 (Q7.2 R18.1 V.1)
BC1: 5-PWR_ADC (R40.1 U25.7), 5-PWR_ADC3 (U23.13)
BC2: 5-PWR_ADC (R42.1 U26.7), 5-PWR_ADC3 (U23.14)
BC3: 5-PWR_ADC (R54.1 U27.7), 5-PWR_ADC3 (U23.15)
BC4: 5-PWR_ADC (R56.1 U28.7), 5-PWR_ADC3 (U23.12)
BC5: 5-PWR_ADC (R68.1 U29.7), 5-PWR_ADC3 (U23.1)
BT_CH_A: 4-PWR_MANAGE_3 (U10.3), 5-PWR_ADC3 (U22.11 U23.11)
BT_CH_B: 4-PWR_MANAGE_3 (U10.2), 5-PWR_ADC3 (U22.10 U23.10)
BT_CH_C: 4-PWR_MANAGE_3 (U10.1), 5-PWR_ADC3 (U22.9 U23.9)
BT_CH_CS: 4-PWR_MANAGE_3 (U10.7), 5-PWR_ADC3 (U22.6 U23.6)
BT_CH_I_IN: 4-PWR_MANAGE_3 (U10.8), 5-PWR_ADC3 (U23.3)
BT_CH_V_IN: 4-PWR_MANAGE_3 (U10.9), 5-PWR_ADC3 (U22.3)
BV1: 5-PWR_ADC2 (R26.2), 5-PWR_ADC3 (U22.13)
BV2: 5-PWR_ADC2 (R27.2), 5-PWR_ADC3 (U22.14)
BV3: 5-PWR_ADC2 (R32.2), 5-PWR_ADC3 (U22.15)
BV4: 5-PWR_ADC2 (R33.2), 5-PWR_ADC3 (U22.12)
BV5: 5-PWR_ADC2 (R37.2), 5-PWR_ADC3 (U22.1)
C_BT1: 2-PWR_MANAGE (-BT1.1 R3.1), 5-PWR_ADC (R39.2 R45.2)
C_BT2: 2-PWR_MANAGE (-BT2.1 R4.1), 5-PWR_ADC (R41.2 R46.2)
C_BT3: 2-PWR_MANAGE (-BT3.1 R5.1), 5-PWR_ADC (R53.2 R59.2)
C_BT4: 2-PWR_MANAGE (-BT4.1 R6.1), 5-PWR_ADC (R55.2 R60.2)
C_BT5: 2-PWR_MANAGE (-BT5.1 R7.1), 5-PWR_ADC (R67.2 R70.2)
DIO_SCL: 2-PWR_MANAGE (R9.2 U9.14), 4-PWR_MANAGE_3 (U10.22)
DIO_SDA: 2-PWR_MANAGE (R8.2 U9.15), 4-PWR_MANAGE_3 (U10.21)
NEGA_PWM: 3-PWR_BAK_BATT (R20.2 R22.2), 4-PWR_MANAGE_3 (U10.13)
V_BT1: 2-PWR_MANAGE (+BT1.1 U1.4 U2.4), 5-PWR_ADC2 (R24.2)
V_BT2: 2-PWR_MANAGE (+BT2.1 U3.4 U4.4), 5-PWR_ADC2 (R25.2)
V_BT3: 2-PWR_MANAGE (+BT3.1 U5.4 U6.4), 5-PWR_ADC2 (R30.2)
V_BT4: 2-PWR_MANAGE (+BT4.1 U7.4 U8.4), 5-PWR_ADC2 (R31.2)
V_BT5: 2-PWR_MANAGE (+BT5.1 Q2.2), 5-PWR_ADC2 (R36.2)